# EAGLE design paddle (EAGLE 7.6.0)
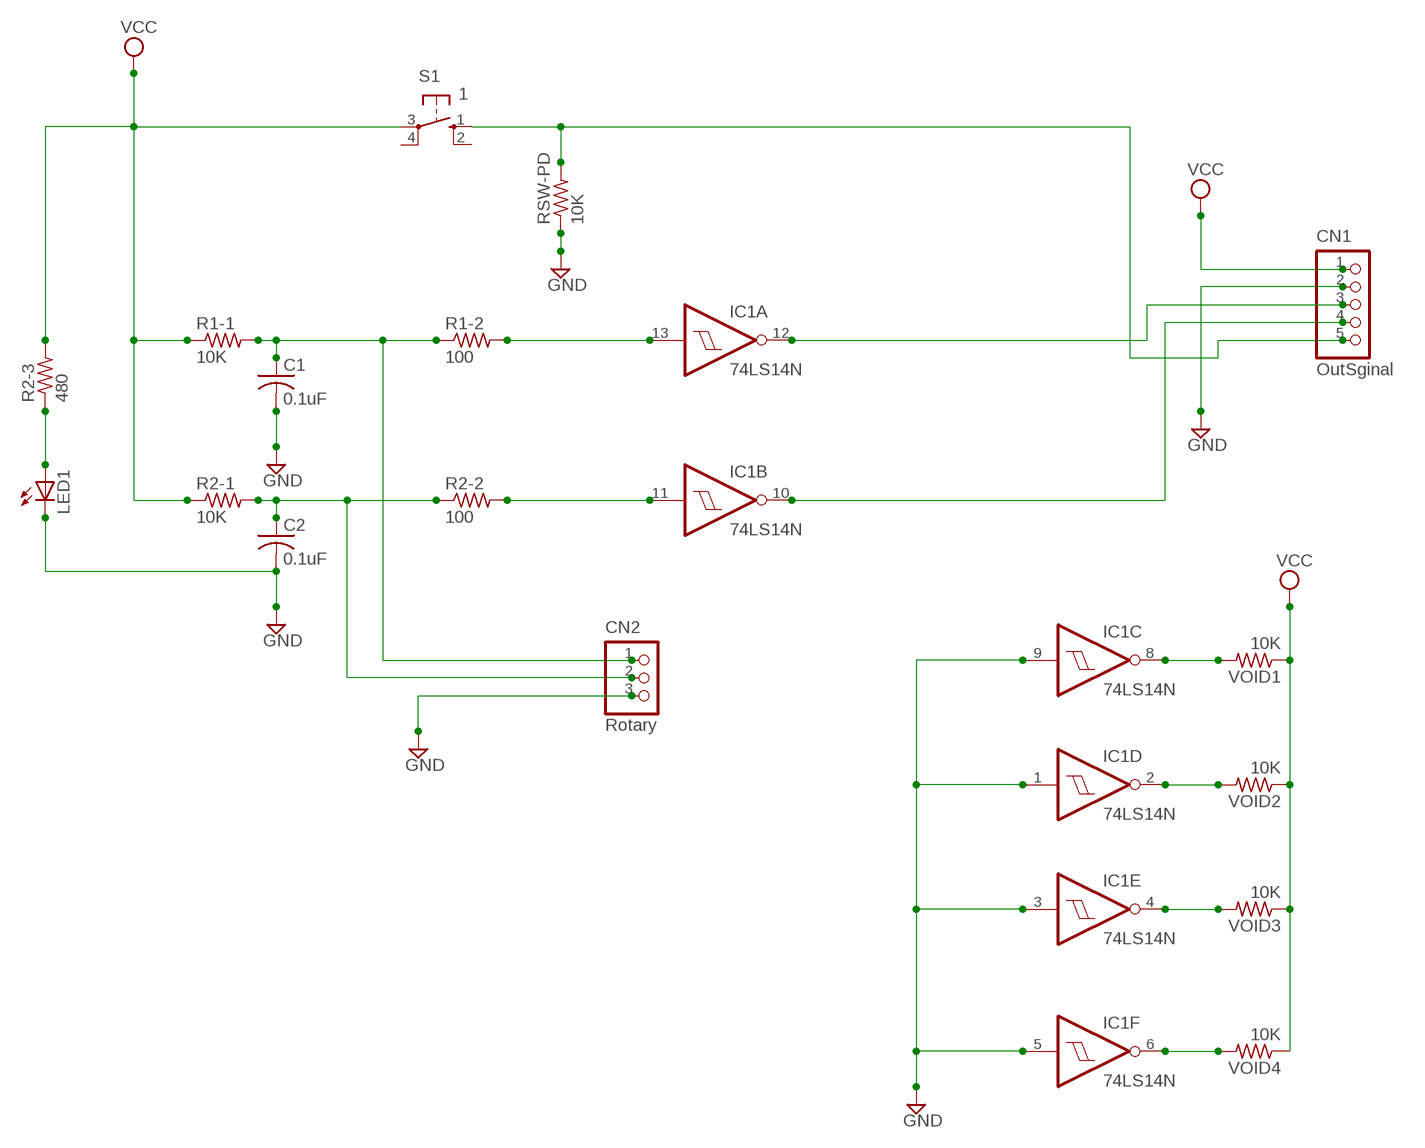
[diagram p0: schematic, sheet 1]

## Parts
C1  0.1uF  C-US050-050X075  [C050-050X075]
C2  0.1uF  C-US050-050X075  [C050-050X075]
CN1  OutSginal  B5B-PH-K-S  [B5B-PH-K-S]
CN2  Rotary  B3B-PH-K-S  [B3B-PH-K-S]
IC1  74LS14N  [DIL14]
LED1  LED3MM  [LED3MM]
R1-1  10K  R-US_0207/2V  [0207/2V]
R1-2  100  R-US_0207/2V  [0207/2V]
R2-1  10K  R-US_0207/2V  [0207/2V]
R2-2  100  R-US_0207/2V  [0207/2V]
R2-3  480  R-US_0207/2V  [0207/2V]
RSW-PD  10K  R-US_0207/2V  [0207/2V]
S1  1  10-XX  [B3F-10XX]
VOID1  10K  R-US_0207/2V  [0207/2V]
VOID2  10K  R-US_0207/2V  [0207/2V]
VOID3  10K  R-US_0207/2V  [0207/2V]
VOID4  10K  R-US_0207/2V  [0207/2V]

## Nets
GND: C1.2 C2.2 CN1.2 CN2.3 IC1.1(D:I) IC1.3(E:I) IC1.5(F:I) IC1.9(C:I) LED1.K(C) RSW-PD.1
N$1: C1.1 CN2.1 R1-1.2 R1-2.1
N$2: IC1.13(A:I) R1-2.2
N$3: C2.1 CN2.2 R2-1.2 R2-2.1
N$4: IC1.11(B:I) R2-2.2
N$5: IC1.8(C:O) VOID1.2
N$6: IC1.2(D:O) VOID2.2
N$7: IC1.4(E:O) VOID3.2
N$8: IC1.6(F:O) VOID4.2
N$9: CN1.5 RSW-PD.2 S1.1(S)
N$10: CN1.3 IC1.12(A:O)
N$11: CN1.4 IC1.10(B:O)
N$12: LED1.A R2-3.1
VCC: CN1.1 R1-1.1 R2-1.1 R2-3.2 S1.3(P) VOID1.1 VOID2.1 VOID3.1 VOID4.1
Unconnected: S1.2(S1) S1.4(P1)

## Power pins joined to a net without a drawn wire
GND: IC1.7(P:GND)
VCC: IC1.14(P:VCC)

## Library data of the parts
C1 C2 = resistor:C-US: CAPACITOR, American symbol
CN1 = jst-ph:B5B-PH-*: Wire-to-Board 2.0mm pitch top mount connector Source: http://www.jst-mfg.com/product/pdf/jpn/PH.pdf http://www.jst-mfg.com/product/detail.php?series=199
CN2 = jst-ph:B3B-PH-*: Wire-to-Board 2.0mm pitch top mount connector Source: http://www.jst-mfg.com/product/pdf/jpn/PH.pdf http://www.jst-mfg.com/product/detail.php?series=199
IC1 = 74xx-us:74*14: Hex schmitt trigger INVERTER
LED1 = led:LED: LED OSRAM: - CHIPLED LG R971, LG N971, LY N971, LG Q971, LY Q971, LO R971, LY R971 LH N974, LH R974 LS Q976, LO Q976, LY Q976 LO Q996 - Hyper CHIPLED LW Q18S LB Q993, LB Q99A, LB R99A - SideLED LS A670, LO A670, LY A670, LG A670, LP A670 LB A673, LV A673, LT A673, LW A673 LH A674 LY A675 LS A676, LA A676, LO A676, LY A676, LW A676 LS A679, LY A679, LG A679 - Hyper Micro SIDELED® LS Y876, LA Y876, LO Y876, LY Y876 LT Y87S - SmartLED LW L88C, LW L88S LB L89C, LB L89S, LG L890 LS L89K, LO L89K, LY L89K LS L896, LA L896, LO L896, LY L896 - TOPLED LS T670, LO T670, LY T670, LG T670, LP T670 LSG T670, LSP T670, LSY T670, LOP T670, LYG T670 LG T671, LOG T671, LSG T671 LB T673, LV T673, LT T673, LW T673 LH T674 LS T676, LA T676, LO T676, LY T676, LB T676, LH T676, LSB T676, LW T676 LB T67C, LV T67C, LT T67C, LS T67K, LO T67K, LY T67K, LW E67C LS E67B, LA E67B, LO E67B, LY E67B, LB E67C, LV E67C, LT E67C LW T67C LS T679, LY T679, LG T679 LS T770, LO T770, LY T770, LG T770, LP T770 LB T773, LV T773, LT T773, LW T773 LH T774 LS E675, LA E675, LY E675, LS T675 LS T776, LA T776, LO T776, LY T776, LB T776 LHGB T686 LT T68C, LB T68C - Hyper Mini TOPLED® LB M676 - Mini TOPLED Santana® LG M470 LS M47K, LO M47K, LY M47K Source: http://www.osram.convergy.de LUXEON: - LUMILED® LXK2-PW12-R00, LXK2-PW12-S00, LXK2-PW14-U00, LXK2-PW14-V00 LXK2-PM12-R00, LXK2-PM12-S00, LXK2-PM14-U00 LXK2-PE12-Q00, LXK2-PE12-R00, LXK2-PE12-S00, LXK2-PE14-T00, LXK2-PE14-U00 LXK2-PB12-K00, LXK2-PB12-L00, LXK2-PB12-M00, LXK2-PB14-N00, LXK2-PB14-P00, LXK2-PB14-Q00 LXK2-PR12-L00, LXK2-PR12-M00, LXK2-PR14-Q00, LXK2-PR14-R00 LXK2-PD12-Q00, LXK2-PD12-R00, LXK2-PD12-S00 LXK2-PH12-R00, LXK2-PH12-S00 LXK2-PL12-P00, LXK2-PL12-Q00, LXK2-PL12-R00 Source: www.luxeon.com KINGBRIGHT: KA-3528ASYC Source: www.kingbright.com
R1-1 R1-2 R2-1-R2-3 RSW-PD VOID1-VOID4 = resistor:R-US_: RESISTOR, American symbol
S1 = switch-omron:10-XX: OMRON SWITCH; MPN: B3F-1000; OC_FARNELL: 176432; OC_NEWARK: 36M3542

## Board
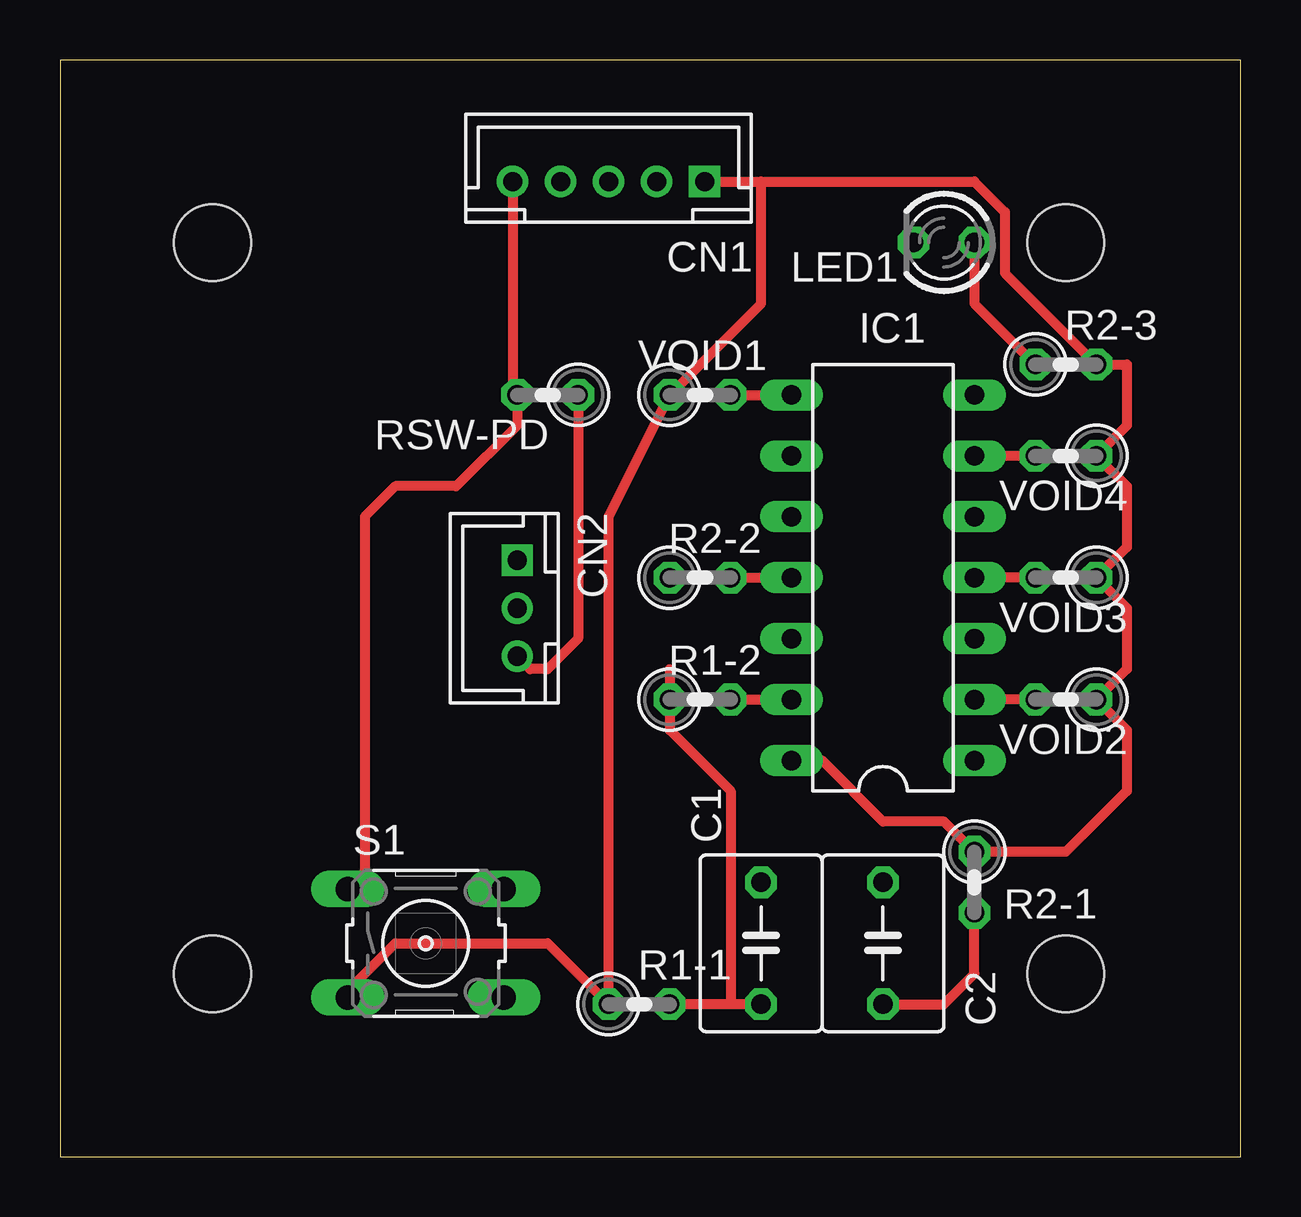
[diagram p1: board, top side]
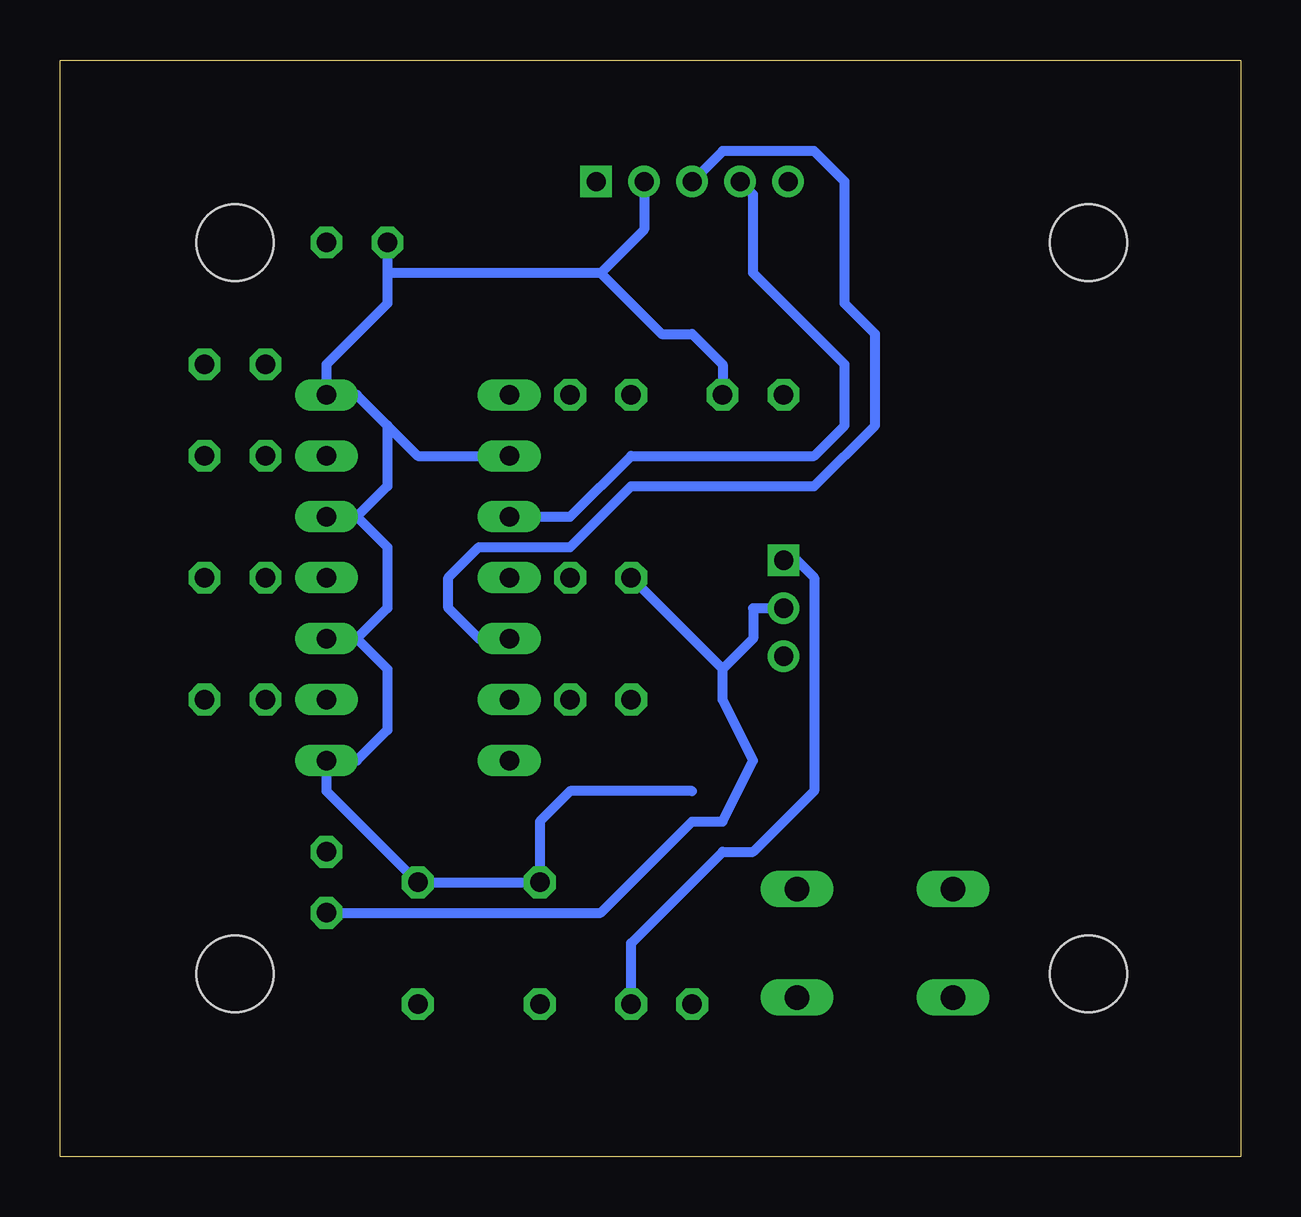
[diagram p2: board, bottom side, seen from below]

Size 49.2 x 45.71 mm. Coordinates in mm from the lower left corner, seen from the top.
Outline: 0,0 49.2,0 49.2,45.71 0,45.71 0,0
Copper layers (1*16): Top 0.035mm / dielectric 1.5mm / Bottom 0.035mm
Design rules "SeeedStudio_2layer_DRU_no_angle_20140221": minimum track width 6mil, minimum drill 12mil, track to track 6mil, track to pad 6mil, pad to pad 6mil, via to via 6mil, smd to smd 0mil, copper to edge 10mil, drill to drill 10mil, minimum pad ring 10mil, minimum via ring 6mil, stop-mask expansion 2mil, vias tented up to drill 100mil, thermal gap 10mil
Holes 3.2 mm at 6.35,38.1 41.91,38.1 6.35,7.62 41.91,7.62

### Footprints (pad centres in the part's own frame; a part is rotated, then mirrored left to right if it is on the bottom)
C050-050X075 = drill 0.813 octagon: 1 -2.54,0; 2 2.54,0
B5B-PH-K-S = drill 0.8 square: 1 -4,0 | drill 0.8: 2 -2,0; 3 0,0; 4 2,0; 5 4,0
B3B-PH-K-S = drill 0.8 square: 1 -2,0 | drill 0.8: 2 0,0; 3 2,0
DIL14 = drill 0.813 long: 1 -7.62,-3.81; 2 -5.08,-3.81; 3 -2.54,-3.81; 4 0,-3.81; 5 2.54,-3.81; 6 5.08,-3.81; 7 7.62,-3.81; 8 7.62,3.81; 9 5.08,3.81; 10 2.54,3.81; 11 0,3.81; 12 -2.54,3.81; 13 -5.08,3.81; 14 -7.62,3.81
LED3MM = drill 0.813 octagon: A -1.27,0; K 1.27,0
0207/2V = drill 0.813 octagon: 1 -1.27,0; 2 1.27,0
B3F-10XX = drill 1.016 long: 1 -3.251,2.261; 2 3.251,2.261; 3 -3.251,-2.261; 4 3.251,-2.261

### Placement (x,y rotation side)
C1  29.21,8.89 90 top
C2  34.29,8.89 90 top
CN1  22.86,40.64 180 top
CN2  19.05,22.86 270 top
IC1  34.29,24.13 90 top
LED1  36.83,38.1 180 top
R1-1  24.13,6.35 0 top
R1-2  26.67,19.05 0 top
R2-1  38.1,11.43 270 top
R2-2  26.67,24.13 0 top
R2-3  41.91,33.02 0 top
RSW-PD  20.32,31.75 180 top
S1  15.24,8.89 0 top
VOID1  26.67,31.75 0 top
VOID2  41.91,19.05 180 top
VOID3  41.91,24.13 180 top
VOID4  41.91,29.21 180 top

### Tracks (layer width: path | path; a pad name or v marks a point on that pad's centre or on a via)
GND
  Top 0.406: RSW-PD.1 21.59,21.59 20.32,20.32 19.59,20.32 CN2.3
  Bottom 0.406: LED1.K 35.56,36.83 | 35.56,36.83 35.56,35.56 38.1,33.02 IC1.7 36.83,31.75 35.56,30.48 | 22.86,15.24 27.94,15.24 29.21,13.97 C1.2 C2.2 38.1,15.24 IC1.1 36.83,16.51 35.56,17.78 35.56,20.32 36.83,21.59 | 26.67,36.83 24.13,34.29 22.86,34.29 21.59,33.02 RSW-PD.1 | 26.67,36.83 35.56,36.83 | 35.56,30.48 34.29,29.21 IC1.9 | 35.56,30.48 35.56,27.94 36.83,26.67 | IC1.5 36.83,26.67 | 36.83,26.67 35.56,25.4 35.56,22.86 36.83,21.59 | IC1.3 36.83,21.59 | CN1.2 24.86,38.64 26.67,36.83
N$1
  Top 0.406: 27.94,6.35 27.94,15.24 25.4,17.78 R1-2.1 25.4,20.32 | C1.1 27.94,6.35 | 27.94,6.35 R1-1.2
  Bottom 0.406: R1-1.2 25.4,8.89 21.59,12.7 20.32,12.7 17.78,15.24 17.78,24.13 18.51,24.86 CN2.1
N$2
  Top 0.406: R1-2.2 IC1.13
N$3
  Top 0.406: C2.1 36.83,6.35 38.1,7.62 R2-1.2
  Bottom 0.406: 21.59,20.32 R2-2.1 | R2-1.2 26.67,10.16 22.86,13.97 21.59,13.97 20.32,16.51 21.59,19.05 21.59,20.32 | 21.59,20.32 20.32,21.59 20.32,22.86 CN2.2
N$4
  Top 0.406: R2-2.2 IC1.11
N$5
  Top 0.406: VOID1.2 IC1.8
N$6
  Top 0.406: VOID2.2 IC1.2
N$7
  Top 0.406: VOID3.2 IC1.4
N$8
  Top 0.406: VOID4.2 IC1.6
N$9
  Top 0.406: S1.1 12.7,11.86 12.7,26.67 13.97,27.94 16.51,27.94 19.05,30.48 RSW-PD.2 18.86,31.94 CN1.5
N$10
  Bottom 0.406: IC1.12 31.75,21.59 33.02,22.86 33.02,24.13 31.75,25.4 27.94,25.4 25.4,27.94 17.78,27.94 15.24,30.48 15.24,34.29 16.51,35.56 16.51,40.64 17.78,41.91 21.59,41.91 CN1.3
N$11
  Bottom 0.406: IC1.10 27.94,26.67 25.4,29.21 17.78,29.21 16.51,30.48 16.51,33.02 20.32,36.83 20.32,40.1 CN1.4
N$12
  Top 0.406: LED1.A 38.1,35.56 R2-3.1
VCC
  Top 0.406: CN1.1 29.21,40.64 | 29.21,40.64 38.1,40.64 39.37,39.37 39.37,36.83 R2-3.2 44.45,33.02 44.45,30.48 VOID4.1 44.45,27.94 44.45,25.4 VOID3.1 44.45,22.86 44.45,20.32 VOID2.1 44.45,17.78 44.45,15.24 41.91,12.7 R2-1.1 36.83,13.97 34.29,13.97 31.75,16.51 IC1.14 | S1.3 11.99,6.91 13.97,8.89 20.32,8.89 R1-1.1 22.86,26.67 VOID1.1 29.21,35.56 29.21,40.64